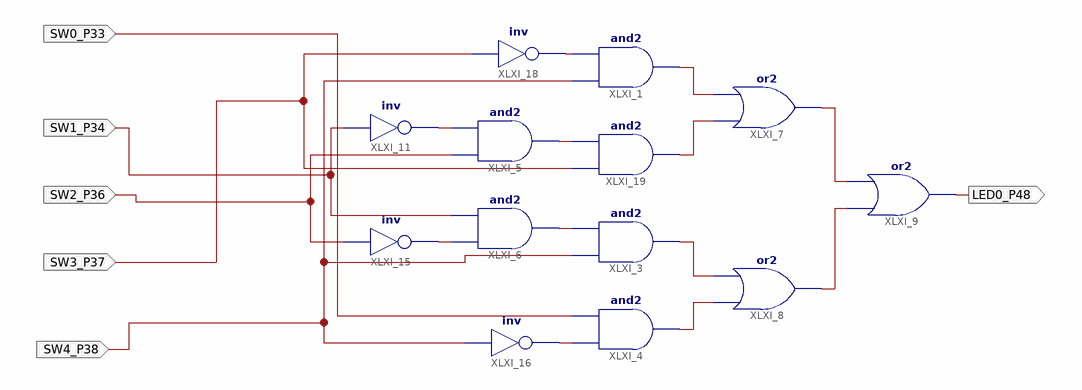
[diagram p0: schematic sheet 1]
// Xilinx ISE schematic CarAlarm.sch (spartan6) as structural Verilog: 13 symbols, 6 ports
module CarAlarm (
  input  SW0_P33,
  input  SW1_P34,
  input  SW2_P36,
  input  SW3_P37,
  input  SW4_P38,
  output LED0_P48
);

  wire XLXN_1, XLXN_2, XLXN_4, XLXN_5, XLXN_6, XLXN_7, XLXN_8, XLXN_9, XLXN_10, XLXN_11, XLXN_13, XLXN_14;

  and XLXI_1 (XLXN_6, SW4_P38, XLXN_10);
  and XLXI_3 (XLXN_8, SW4_P38, XLXN_2);
  and XLXI_4 (XLXN_9, XLXN_14, SW0_P33);
  and XLXI_5 (XLXN_1, SW2_P36, XLXN_11);
  and XLXI_6 (XLXN_2, XLXN_13, SW1_P34);
  or XLXI_7 (XLXN_4, XLXN_7, XLXN_6);
  or XLXI_8 (XLXN_5, XLXN_9, XLXN_8);
  or XLXI_9 (LED0_P48, XLXN_5, XLXN_4);
  not XLXI_11 (XLXN_11, SW1_P34);
  not XLXI_15 (XLXN_13, SW2_P36);
  not XLXI_16 (XLXN_14, SW4_P38);
  not XLXI_18 (XLXN_10, SW3_P37);
  and XLXI_19 (XLXN_7, SW3_P37, XLXN_1);
endmodule
